# Altium schematic sheet pa-ldo.SchDoc: Power Amplifier
size Letter; CheckedBy: J. Brinton; CompanyName: Signal Laboratories, Inc.; DrawnBy: J. Brinton; Engineer: J. Brinton; Address1: 3479 Edison Way; Address2: Menlo Park CA 94025; Address3: +1 (877) 778-8435; Address4: siglabs.com; Revision: 3; SheetNumber: 9; SheetTotal: 49; ModifiedDate: 4/20/2018
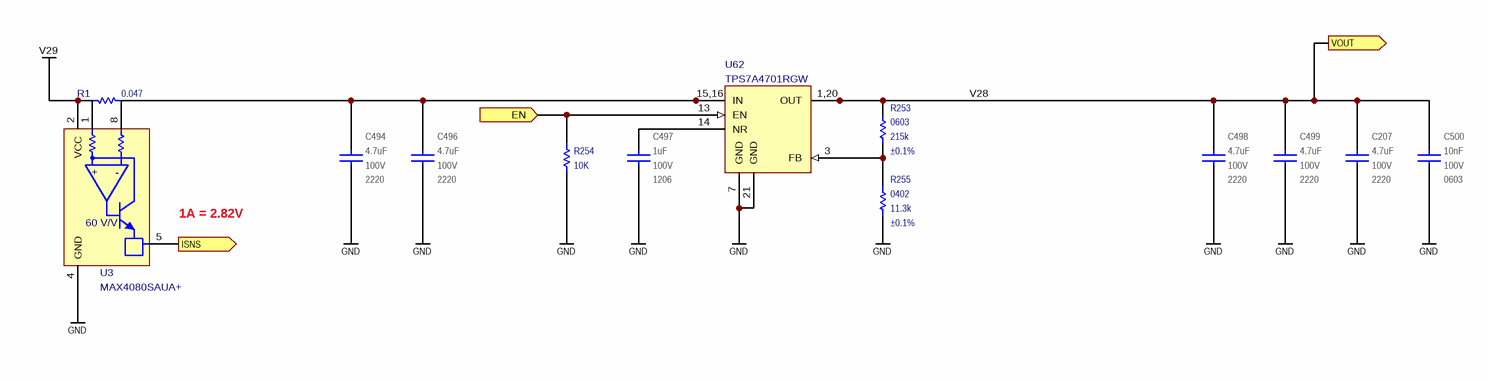
[diagram p0: pa-ldo.SchDoc]

## Parts
C207  value 4.7uF  Voltage: 100V  Package: 2220  [CAPC570X500X230L57N]  (hidden comment: C5750X7R2A475K230KA)
C494  value 4.7uF  Voltage: 100V  Package: 2220  [CAPC570X500X230L57N]  (hidden comment: C5750X7R2A475K230KA)
C496  value 4.7uF  Voltage: 100V  Package: 2220  [CAPC570X500X230L57N]  (hidden comment: C5750X7R2A475K230KA)
C497  value 1uF  Voltage: 100V  Package: 1206  [CAPC3216X130L55N]  (hidden comment: C3216X7R2A105K160AA)
C498  value 4.7uF  Voltage: 100V  Package: 2220  [CAPC570X500X230L57N]  (hidden comment: C5750X7R2A475K230KA)
C499  value 4.7uF  Voltage: 100V  Package: 2220  [CAPC570X500X230L57N]  (hidden comment: C5750X7R2A475K230KA)
C500  value 10nF  Voltage: 100V  Package: 0603  [CAPC1608X90N]  (hidden comment: 06031C103JAT2A)
R1  value 0.047  [KRL3216T4]  (hidden comment: KRL3216T4A-M-R047-F-T1)
R253  value 215k  Tolerance: ±0.1%  Package: 0603  [RESC1608X55N]  (hidden comment: ERA-3AEB2153V)
R254  value 10K  [RESC1005X40N]  (hidden comment: ERJ-2RKF1002X)
R255  value 11.3k  Tolerance: ±0.1%  Package: 0402  [RESC1005X40N]  (hidden comment: RT0402BRD0711K3L)
U3  MAX4080SAUA+  [uMAX8]
U62  TPS7A4701RGW  [QFN65P500X500X100-21N]

## Ports
EN (in), ISNS (out), VOUT (out)

## Nets
GND: C207.1 C494.1 C496.1 C497.1 C498.1 C499.1 C500.1 R254.2 R255.1 U3.4(GND) U62.7(GND) U62.21(GND)
V29: R1.1 U3.2(VCC)
EN: R254.1 U62.13(EN) ; port EN
ISNS: U3.5(OUT) ; port ISNS
V28: C207.2 C498.2 C499.2 C500.2 R253.2 U62.1(OUT) U62.20(OUT) ; port VOUT
NetC494_2: C494.2 C496.2 R1.2 U62.15(IN) U62.16(IN)
NetC497_2: C497.2 U62.14(NR)
NetR1_3: R1.3 U3.1(RS+)
NetR1_4: R1.4 U3.8(RS-)
NetR253_1: R253.1 R255.2 U62.3(FB)

Not connected (* = marked no-connect by the designer): U62 4(6.4P2) 5(6.4V1) 6(3.2V) 8(1.6V) 9(800MV) 10(400MV) 11(200MV) 12(100MV)

## Notes on the sheet
- (near U3) 1A = 2.82V
- Title
- Engineer
- Revision
- Drawn By
- Checked By
- Date
- Sheet
- of
- (in symbol MAX4080SAUA+) +; -; 60 V/V
- (in symbol TPS7A4701RGW) 15,16; 1,20

## Library data of the parts
C207 C494 C496 C498 C499 = CAP: Ceramic Capacitor 4.7uF ±10% 100V X7R 2220; Manufacturer: TDK; Tr: -55:125; Manufacturer P/N: C5750X7R2A475K230KA; Tolerance: ±10%
C497 = CAP: Ceramic Capacitor 1uF ±10% 100V X7R 1206; Manufacturer: TDK; Tr: -55:125; Manufacturer P/N: C3216X7R2A105K160AA; Tolerance: ±10%
C500 = CAP: Ceramic Capacitor 10nF ±5% 100V X7R 0603; Manufacturer: AVC; Tr: -55:125; Manufacturer P/N: 06031C103JAT2A; Tolerance: ±5%
R1 = KRL3216T4A-M-R009-F: Current Sense Resistor 47 mOhms +/-1% SMD 4-Terminal; Manufacturer: Susumu; Tolerance: ±1%; Tr: -55:+155; Manufacturer P/N: KRL3216T4A-M-R047-F-T1
R253 = RES: Thin Film Resistor 215k +/-0.1% SMD 0603; Manufacturer: Panasonic; Tr: -55:155; Power: 0.1W; Tcr: *; Manufacturer P/N: ERA-3AEB2153V; Alternatives: *; Voltage: *
R254 = RES 0402: Thick Film Resistor 10k ±1% 0.1W 50V 0402; Manufacturer: Panasonic; Tr: -55:155; Package: 0402; Manufacturer P/N: ERJ-2RKF1002X; Tolerance: ±1%
R255 = RES: Thin Film Resistor 11.3k +/-0.1% SMD 0402; Manufacturer: Yageo; Tr: -55:155; Power: 0.063W; Tcr: *; Manufacturer P/N: RT0402BRD0711K3L; Alternatives: *; Voltage: *
U3 = MAX4080SAUA+: High-Side Current-Sense Amplifier; Manufacturer: Maxim; Manufacturer P/N: MAX4080SAUA+
U62 = TPS7A4701RGW: Low-Dropout Linear Regulator 20-VQFN; Manufacturer: Texas Instruments; Manufacturer P/N: TPS7A4701RGW; Package: VQFN-20